# Altium schematic sheet Schematic_worm_robot_control_v1.SchDoc
size B
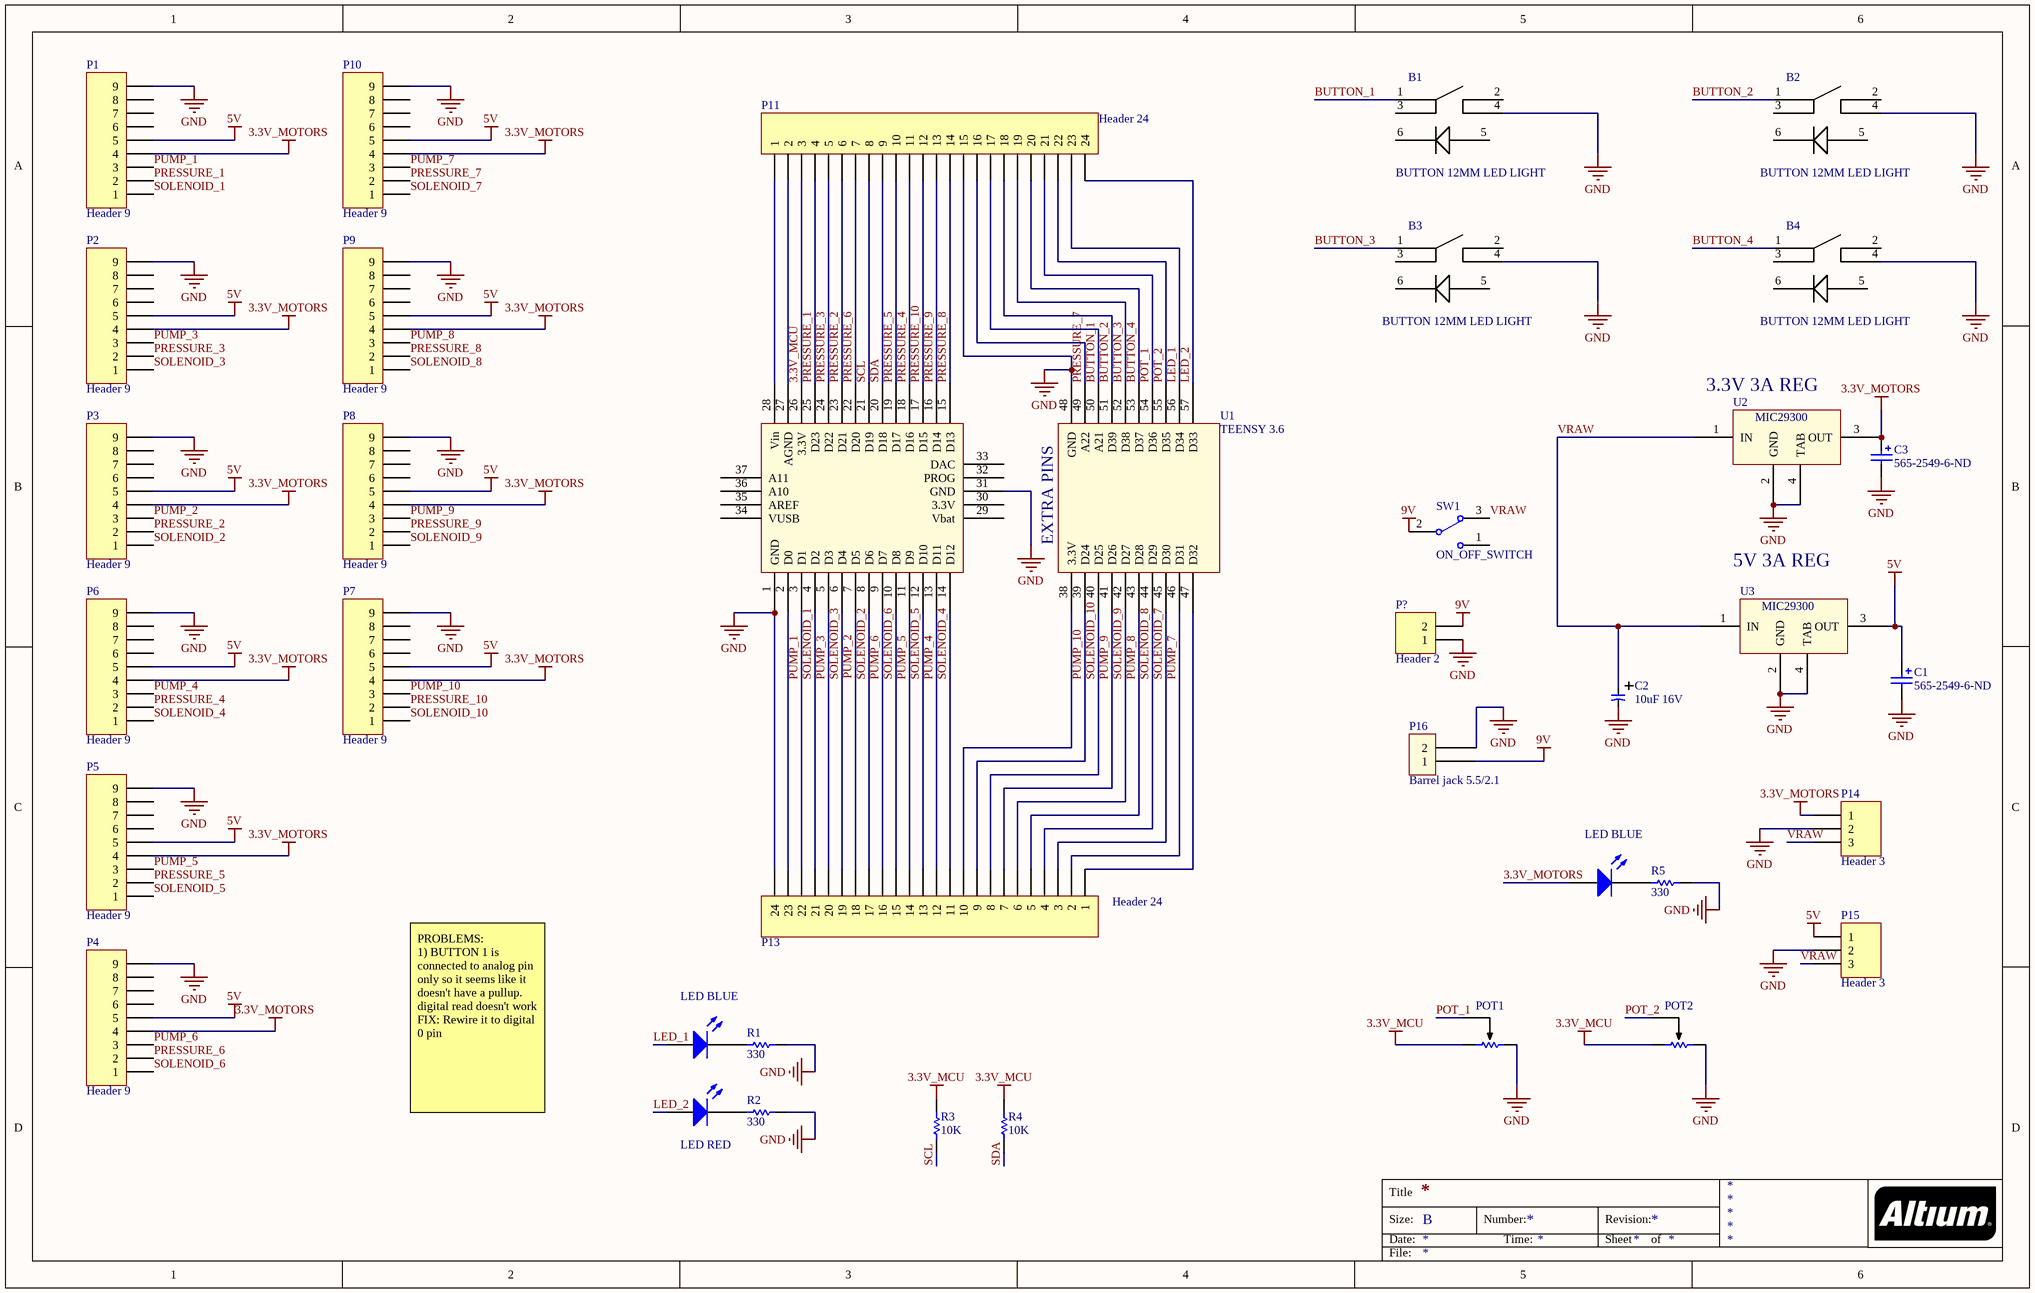
[diagram p0: Schematic_worm_robot_control_v1.SchDoc]

## Parts
B1  BUTTON 12MM LED LIGHT  [12MM BUTTON LED LIGHT]
B2  BUTTON 12MM LED LIGHT  [12MM BUTTON LED LIGHT]
B3  BUTTON 12MM LED LIGHT  [12MM BUTTON LED LIGHT]
B4  BUTTON 12MM LED LIGHT  [12MM BUTTON LED LIGHT]
C1  Supplier Part Number 1: 565-2549-6-ND  [F80 Electrolytic cap]  (hidden comment: Electrolytic Cap 100uF smd)
C2  10uF 16V  [CAP0805]
C3  Supplier Part Number 1: 565-2549-6-ND  [F80 Electrolytic cap]  (hidden comment: Electrolytic Cap 100uF smd)
LED1  LED BLUE  [RES_1206_SMD]
LED2  LED RED  [RES_1206_SMD]
LED3  LED BLUE  [RES_1206_SMD]
P1  Header 9  [HDR1X9]
P2  Header 9  [HDR1X9]
P3  Header 9  [HDR1X9]
P4  Header 9  [HDR1X9]
P5  Header 9  [HDR1X9]
P6  Header 9  [HDR1X9]
P7  Header 9  [HDR1X9]
P8  Header 9  [HDR1X9]
P9  Header 9  [HDR1X9]
P10  Header 9  [HDR1X9]
P11  Header 24  [HDR1X24]
P13  Header 24  [HDR1X24]
P14  Header 3  [HDR1X3]
P15  Header 3  [HDR1X3]
P16  Barrel jack 5.5/2.1  [ADC-028-2]
P?  Header 2  [HDR1X2]
POT1  Potentiometer large  [PRS11S]  (value not drawn)
POT2  Potentiometer large  [PRS11S]  (value not drawn)
R1  330  [0603W]
R2  330  [0603W]
R3  10K  [0603W]
R4  10K  [0603W]
R5  330  [0603W]
SW1  ON_OFF_SWITCH  [SS321 Switch]
U1  TEENSY 3.6  [TEENSY 3.6]
U2  MIC29300  [TO263]
U3  MIC29300  [TO263]

## Nets
3.3V_MCU: P11.3 POT1.1 POT2.1 R3.1 R4.1 U1.26(3.3V)
3.3V_MOTORS: C3.1 LED3.1(A) P1.4 P2.4 P3.4 P4.4 P5.4 P6.4 P7.4 P8.4 P9.4 P10.4 P14.1 U2.3(OUT)
5V: C1.1 P1.5 P2.5 P3.5 P4.5 P5.5 P6.5 P7.5 P8.5 P9.5 P10.5 P15.1 U3.3(OUT)
9V: P16.1 P?.2 SW1.2
GND: B1.4 B2.4 B3.4 B4.4 C1.2 C2.2 C3.2 P1.9 P2.9 P3.9 P4.9 P5.9 P6.9 P7.9 P8.9 P9.9 P10.9 P11.15 P13.24 P14.2 P15.2 P16.2 P?.1 POT1.3 POT2.3 R1.1 R2.1 R5.1 U1.1(GND) U1.31(GND) U1.48(GND) U2.2(GND) U2.4(TAB) U3.2(GND) U3.4(TAB)
BUTTON_1: B1.1 P11.17 U1.50(A21)
BUTTON_2: B2.1 P11.18 U1.51(D39)
BUTTON_3: B3.1 P11.19 U1.52(D38)
BUTTON_4: B4.1 P11.20 U1.53(D37)
LED_1: LED1.1(A) P11.23 U1.56(D34)
LED_2: LED2.1(A) P11.24 U1.57(D33)
POT_1: P11.21 POT1.2 U1.54(D36)
POT_2: P11.22 POT2.2 U1.55(D35)
PRESSURE_1: P1.2 P11.4 U1.25(D23)
PRESSURE_2: P3.2 P11.6 U1.23(D21)
PRESSURE_3: P2.2 P11.5 U1.24(D22)
PRESSURE_4: P6.2 P11.11 U1.18(D16)
PRESSURE_5: P5.2 P11.10 U1.19(D17)
PRESSURE_6: P4.2 P11.7 U1.22(D20)
PRESSURE_7: P10.2 P11.16 U1.49(A22)
PRESSURE_8: P9.2 P11.14 U1.15(D13)
PRESSURE_9: P8.2 P11.13 U1.16(D14)
PRESSURE_10: P7.2 P11.12 U1.17(D15)
PUMP_1: P1.3 P13.22 U1.3(D1)
PUMP_2: P3.3 P13.18 U1.7(D5)
PUMP_3: P2.3 P13.20 U1.5(D3)
PUMP_4: P6.3 P13.12 U1.13(D11)
PUMP_5: P5.3 P13.14 U1.11(D9)
PUMP_6: P4.3 P13.16 U1.9(D7)
PUMP_7: P10.3 P13.2 U1.46(D31)
PUMP_8: P9.3 P13.5 U1.43(D28)
PUMP_9: P8.3 P13.7 U1.41(D26)
PUMP_10: P7.3 P13.9 U1.39(D24)
SCL: P11.8 R3.2 U1.21(D19)
SDA: P11.9 R4.2 U1.20(D18)
SOLENOID_1: P1.1 P13.21 U1.4(D2)
SOLENOID_2: P3.1 P13.17 U1.8(D6)
SOLENOID_3: P2.1 P13.19 U1.6(D4)
SOLENOID_4: P6.1 P13.11 U1.14(D12)
SOLENOID_5: P5.1 P13.13 U1.12(D10)
SOLENOID_6: P4.1 P13.15 U1.10(D8)
SOLENOID_7: P10.1 P13.3 U1.45(D30)
SOLENOID_8: P9.1 P13.4 U1.44(D29)
SOLENOID_9: P8.1 P13.6 U1.42(D27)
SOLENOID_10: P7.1 P13.8 U1.40(D25)
VRAW: C2.1 P14.3 P15.3 SW1.3 U2.1(IN) U3.1(IN)
NetLED1_2: LED1.2(K) R1.2
NetLED2_2: LED2.2(K) R2.2
NetLED3_2: LED3.2(K) R5.2
NetP11_1: P11.1 U1.28(Vin)
NetP11_2: P11.2 U1.27(AGND)
NetP13_1: P13.1 U1.47(D32)
NetP13_10: P13.10 U1.38(3.3V)
NetP13_23: P13.23 U1.2(D0)

Not connected (* = marked no-connect by the designer): B1 2 3 5 6; B2 2 3 5 6; B3 2 3 5 6; B4 2 3 5 6; P1 6 7 8; P2 6 7 8; P3 6 7 8; P4 6 7 8; P5 6 7 8; P6 6 7 8; P7 6 7 8; P8 6 7 8; P9 6 7 8; P10 6 7 8; SW1 1; U1 29(Vbat) 30(3.3V) 32(PROG) 33(DAC) 34(VUSB) 35(AREF) 36(A10) 37(A11)

## Notes on the sheet
- (near U2) 3.3V 3A REG
- 5V 3A REG
- PROBLEMS:
  1) BUTTON 1 is connected to analog pin only so it seems like it doesn't have a pullup. digital read doesn't work
  FIX: Rewire it to digital 0 pin
- Title
- Size:
- Date:
- B
- Number:
- Time:
- Revision:
- Sheet
- of
- File:
- (in symbol TEENSY 3.6) EXTRA PINS

## Library data of the parts
C1 C3 = Electrolytic Cap 100uF smd: 100uF 25 VSMD; manufacturer: United Chemi-Con; manufacturer part number: EMZA250ADA101MF80G; digikey part number: 565-2549-1-ND; Supplier 1: Digikey
C2 = Polarized Cap
LED1-LED3 = LED: LED SMD 1206/0603; Supplier 1: Digikey
  LED1 LED3: Supplier Part Number 1: LNJ947W8CRACT-ND
  LED2: Supplier Part Number 1: LNJ247W82RACT-ND
P1-P10 = Header 9: Header, 9-Pin; LatestRevisionDate: 17-Jul-2002; LatestRevisionNote: Re-released for DXP Platform.; Publisher: Altium Limited
P11 P13 = Header 24: Header, 24-Pin; LatestRevisionDate: 17-Jul-2002; LatestRevisionNote: Re-released for DXP Platform.; Publisher: Altium Limited
P14 P15 = Header 3: Header, 3-Pin; LatestRevisionDate: 17-Jul-2002; LatestRevisionNote: Re-released for DXP Platform.; Publisher: Altium Limited
P16 = Barrel jack 5.5/2.1: sparkfun part number: 12748
P? = Header 2: Header, 2-Pin; LatestRevisionDate: 17-Jul-2002; LatestRevisionNote: Re-released for DXP Platform.; Publisher: Altium Limited
POT1 POT2 = Potentiometer large: SMD Large pot for audio; Supplier 1: Digikey; Supplier Part Number 1: PRS11S-N20F-103B1-ND
R1-R5 = Resistor: Supplier 1: Digikey
  R1 R2 R5: digikey number: RMCF0603FT10K0CT-ND; Supplier Part Number 1: 311-330JRCT-ND
  R3 R4: Supplier Part Number 1: 311-10KJRCT-ND
SW1 = ON_OFF_SWITCH: SPDT SMD Side Switch; Sparkfun#: COM-00597; digikey number: 563-1102-1-ND
U2 U3 = MIC29300: 3A LDO; Supplier 1: Digi-Key; Supplier Part Number 1: MIC29300-3.3WU-CT-ND